# Altium project F143-MINI-KIT-902-FE-SMA_v1-0-2b.PrjPcb
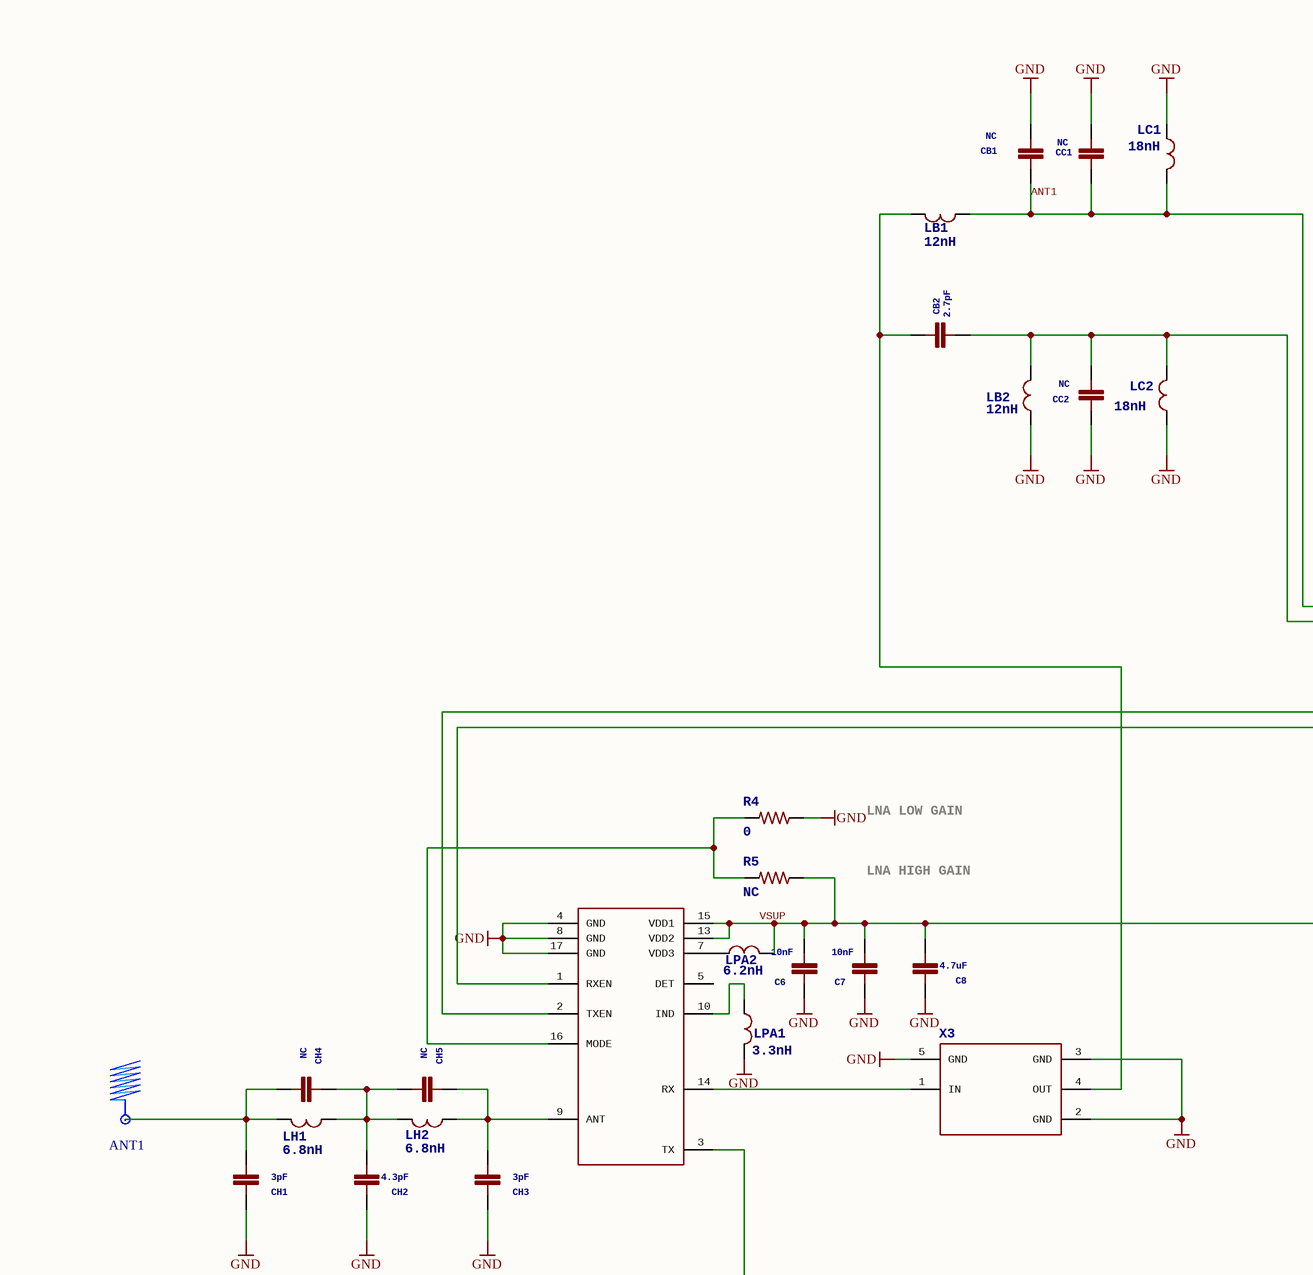
[diagram p0: F143-MINI-KIT-902-FE-SMA_v1-0-2b.SchDoc, top left]
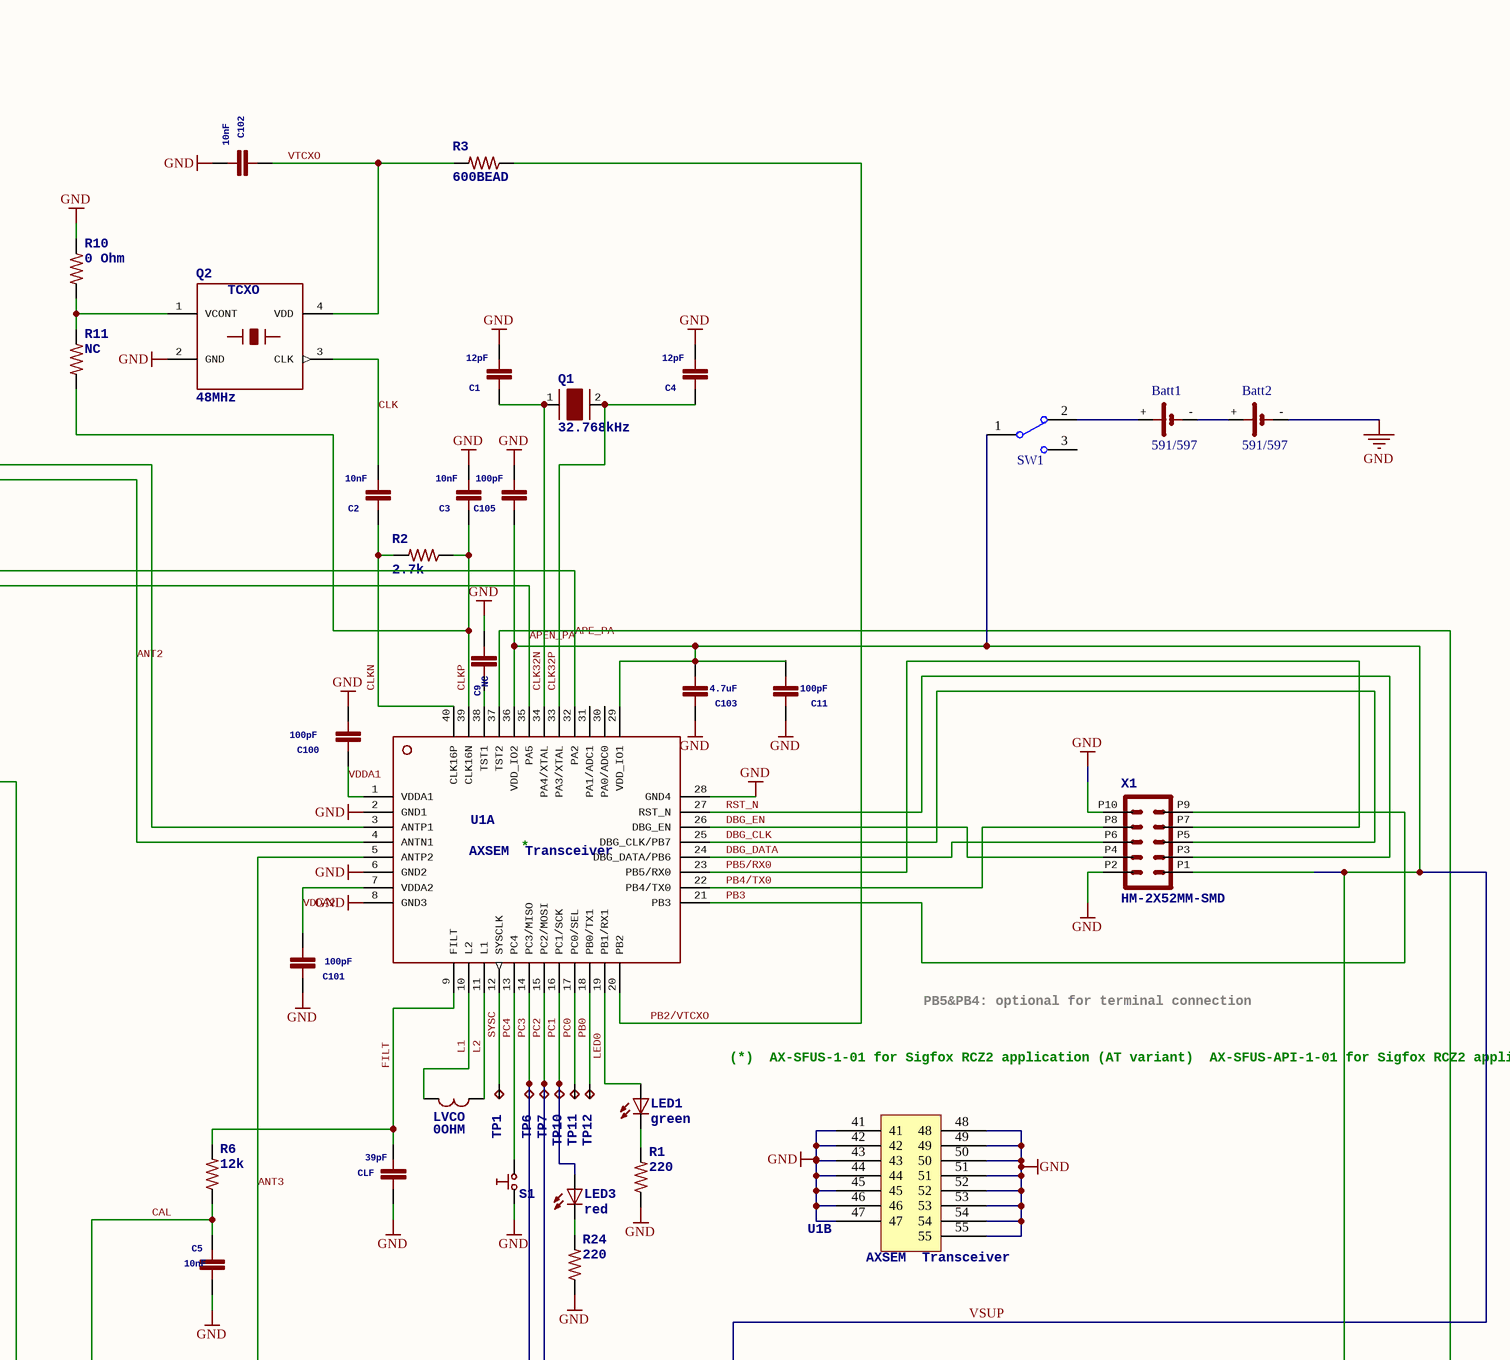
[diagram p1: F143-MINI-KIT-902-FE-SMA_v1-0-2b.SchDoc, top right]
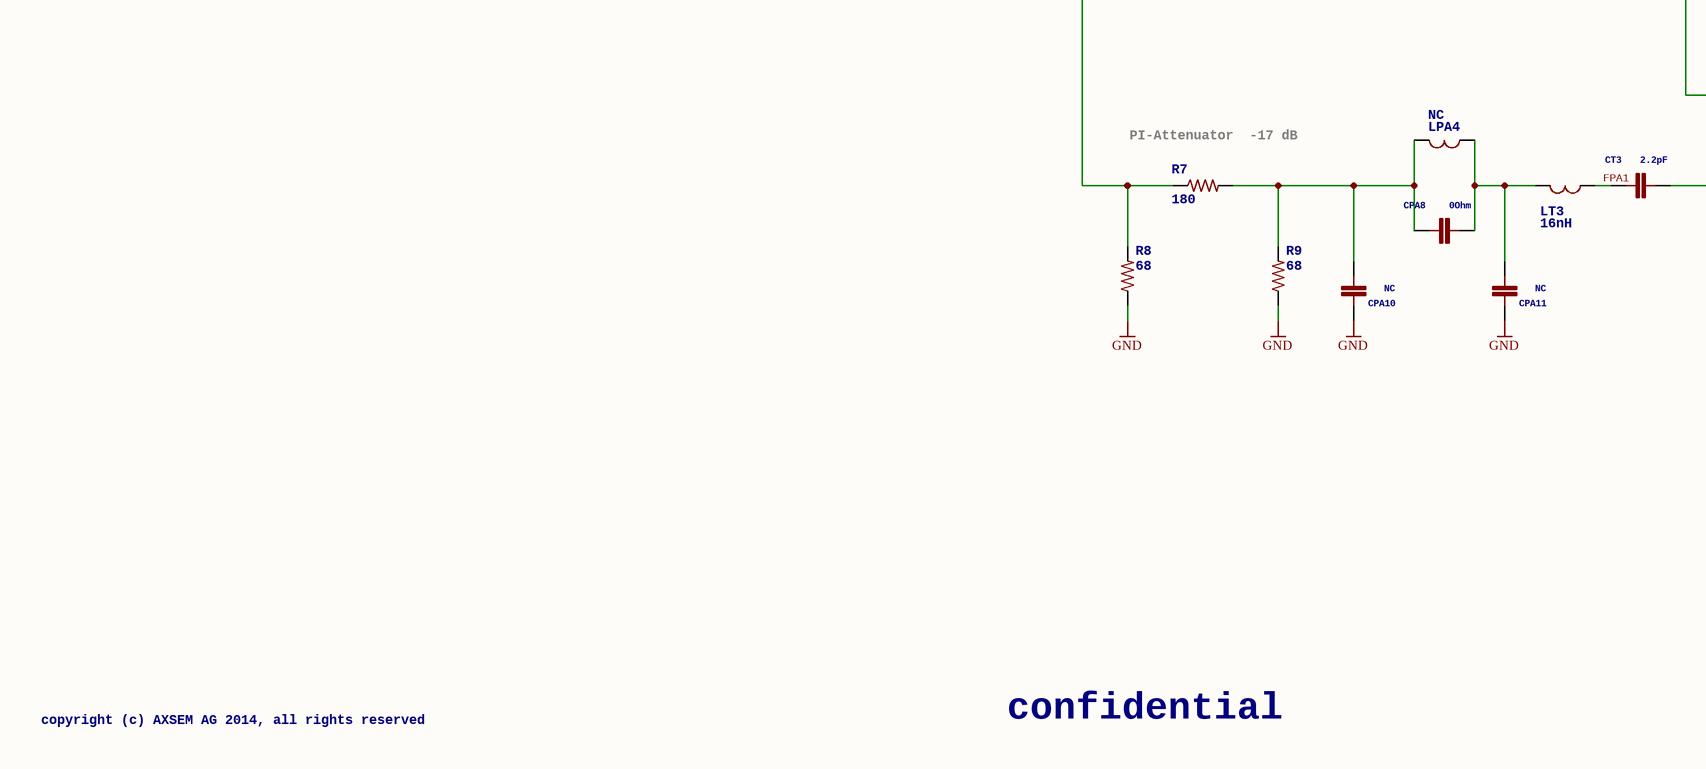
[diagram p2: F143-MINI-KIT-902-FE-SMA_v1-0-2b.SchDoc, bottom left]
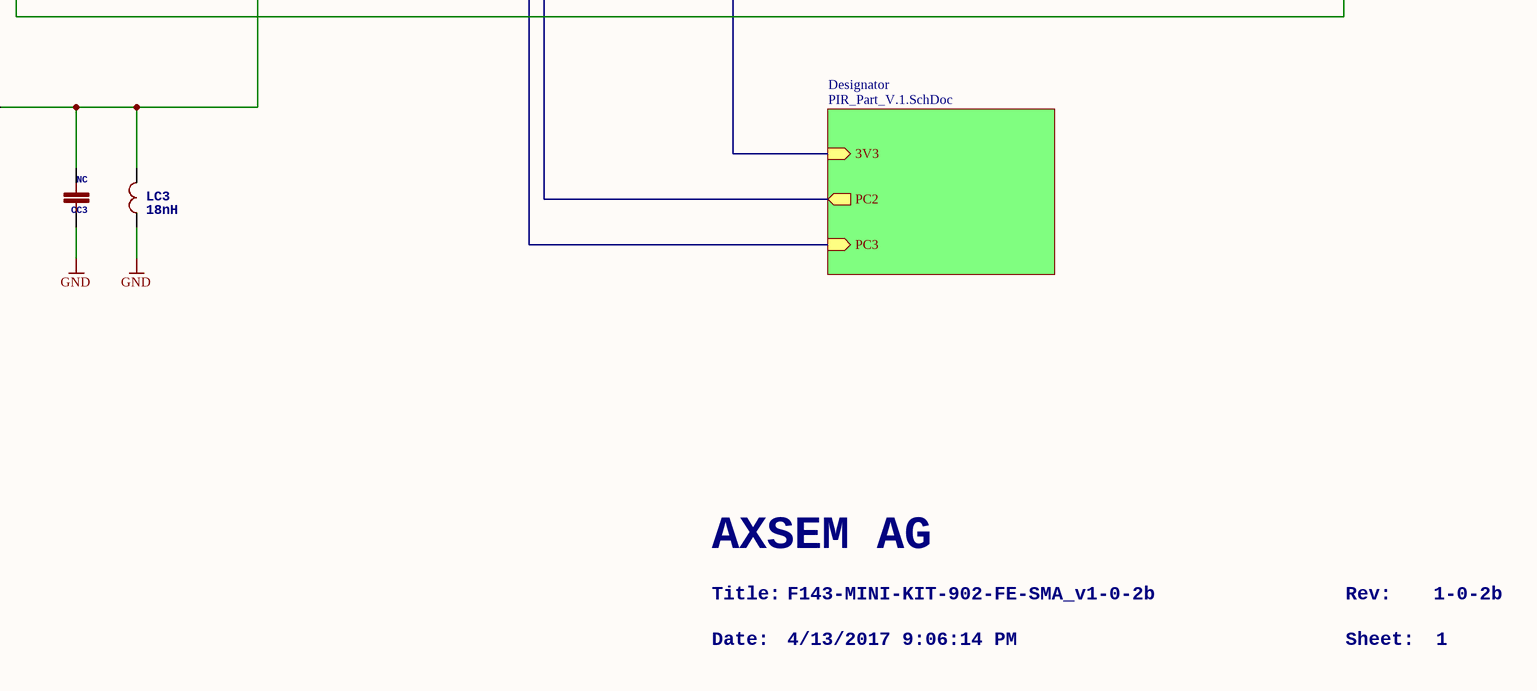
[diagram p3: F143-MINI-KIT-902-FE-SMA_v1-0-2b.SchDoc, bottom right]
2 sheets, 100 parts. Net scope: hierarchical (ports join the sheet entries above them; power ports are global).
Board file: F143-MINI-KIT-902-FE-SMA_v1-0-2b.PcbDoc
Sheets:
  F143-MINI-KIT-902-FE-SMA_v1-0-2b.SchDoc
    Designator = PIR_Part_V.1.SchDoc

## Sheet F143-MINI-KIT-902-FE-SMA_v1-0-2b.SchDoc: F143-MINI-KIT-902-FE-SMA_v1-0-2b
size 555 x 399 mm; Date: 4/13/2017 9:06:14 PM; SheetNumber: 1; REV: 1-0-2b

### Parts
ANT1  SW868-TH13  [Spring Antenna]  (value not drawn)
Batt1  591/597  [Battery Clip AAA]
Batt2  591/597  [Battery Clip AAA]
C1  12pF  [C0402]
C2  10nF  [C0402]
C3  10nF  [C0402]
C4  12pF  [C0402]
C5  10nF  [C0402]
C6  10nF  [C0402]
C7  10nF  [C0402]
C8  4.7uF  [C0603]
C9  NC  [C0402]
C11  100pF  [C0402]
C100  100pF  [C0402]
C101  100pF  [C0402]
C102  10nF  [C0402]
C103  4.7uF  [C0603]
C105  100pF  [C0402]
CB1  NC  [C0402]
CB2  2.7pF  [C0402]
CC1  NC  [C0402]
CC2  NC  [C0402]
CC3  NC  [C0402]
CH1  3pF  [C0402]
CH2  4.3pF  [C0402]
CH3  3pF  [C0402]
CH4  NC  [C0402]
CH5  NC  [C0402]
CLF  39pF  [C0402]
CPA8  0Ohm  [C0402]
CPA10  NC  [C0402]
CPA11  NC  [C0402]
CT3  2.2pF  [C0402]
LB1  12nH  [L0402]
LB2  12nH  [L0402]
LC1  18nH  [L0402]
LC2  18nH  [L0402]
LC3  18nH  [L0402]
LED1  green  [LED0603]
LED3  red  [LED0603]
LH1  6.8nH  [L0402]
LH2  6.8nH  [L0402]
LPA1  3.3nH  [L0402]
LPA2  6.2nH  [L0402]
LPA4  NC  [L0402]
LT3  16nH  [L0402]
LVCO  0OHM  [L0402]
Q1  32.768kHz  [TF20]
Q2  48MHz  [X2016]
R1  220  [R0402]
R2  2.7k  [R0402]
R3  600BEAD  [R0402]
R4  0  [R0402]
R5  NC  [R0402]
R6  12k  [R0402]
R7  180  [R0402]
R8  68  [R0402]
R9  68  [R0402]
R10  0 Ohm  [R0402]
R11  NC  [R0402]
R24  220  [R0402]
S1  (no value)  [TASTER_SMALL_SMD_4PAD]
SW1  MS-22D01  [SW MS-22D01]  (value not drawn)
TP1  (no value)  [PIN-03]
TP6  (no value)  [PIN-03]
TP7  (no value)  [PIN-03]
TP10  (no value)  [PIN-03]
TP11  (no value)  [PIN-03]
TP12  (no value)  [PIN-03]
U1  AXSEM
Transceiver: AXSEM / Transceiver  [QFN40]  (hidden comment: SFUSN)  (parts A,B of 2)
U$2  (no value)  [QFN16_TH]
X1  HM-2X52MM-SMD  [HM-2MM-2X5-SMD]
X3  (no value)  [SAW_1.4X1.1X0.5]

### Sub-sheets
Designator = PIR_Part_V.1.SchDoc: 3V3 (in), PC2 (out), PC3 (in)

### Nets
GND: Batt2.- C1.1 C3.1 C4.1 C5.2 C6.2 C7.2 C8.2 C9.1 C11.2 C100.1 C101.2 C102.1 C103.2 C105.1 CB1.2 CC1.2 CC2.1 CC3.2 CH1.2 CH2.2 CH3.2 CLF.2 CPA10.2 CPA11.2 LB2.1 LC1.1 LC2.1 LC3.1 LPA1.2 Q2.2(GND) R1.3 R4.3 R8.3 R9.3 R10.3 R24.3 S1.P3 U1.2(GND1) U1.6(GND2) U1.8(GND3) U1.28(GND4) U1.41 U1.42 U1.43 U1.44 U1.45 U1.46 U1.47 U1.48 U1.49 U1.50 U1.51 U1.52 U1.53 U1.54 U1.55 U$2.4(GND) U$2.8(GND) U$2.17(GND) X1.P2 X1.P10 X3.2(GND) X3.3(GND) X3.5(GND)
ANT1: CB1.1 CC1.1 LB1.1 LC1.2 U1.3(ANTP1)
ANT2: CB2.2 CC2.2 LB2.2 LC2.2 U1.4(ANTN1)
ANT3: CC3.1 CT3.2 LC3.2 U1.5(ANTP2)
APE_PA: U1.32(PA2) U$2.2(TXEN)
APEN_PA: U1.35(PA5) U$2.1(RXEN)
CAL: C5.1 R6.3 U1.37(TST2)
CLK: C2.1 Q2.3(CLK)
CLK32N: C1.2 Q1.1(P1) U1.34(PA4/XTAL)
CLK32P: C4.2 Q1.2(P2) U1.33(PA3/XTAL)
CLKN: C2.2 R2.4 U1.40(CLK16P)
CLKP: C3.2 R2.3 R11.4 U1.39(CLK16N)
DBG_CLK: U1.25(DBG_CLK/PB7) X1.P5
DBG_DATA: U1.24(DBG_DATA/PB6) X1.P6
DBG_EN: U1.26(DBG_EN) X1.P4
FILT: CLF.1 R6.4 U1.9(FILT)
FPA1: CT3.1 LT3.1
L1: LVCO.2 U1.10(L2)
L2: LVCO.1 U1.11(L1)
LED0: LED1.A U1.19(PB1/RX1)
PB0: TP12.P$1(TP) U1.18(PB0/TX1)
PB2/VTCXO: R3.3 U1.20(PB2)
PB3: U1.21(PB3) X1.P9
PB4/TX0: U1.22(PB4/TX0) X1.P8
PB5/RX0: U1.23(PB5/RX0) X1.P7
PC0: TP11.P$1(TP) U1.17(PC0/SEL)
PC1: LED3.A TP10.P$1(TP) U1.16(PC1/SCK)
PC2: TP7.P$1(TP) U1.15(PC2/MOSI) ; sheet Designator/PC2
PC3: TP6.P$1(TP) U1.14(PC3/MISO) ; sheet Designator/PC3
PC4: S1.P1 U1.13(PC4)
RST_N: U1.27(RST_N) X1.P3
SYSC: TP1.P$1(TP) U1.12(SYSCLK)
VDDA1: C100.2 U1.1(VDDA1)
VDDA2: C101.1 U1.7(VDDA2)
VSUP: C6.1 C7.1 C8.1 C11.1 C103.1 C105.2 LPA2.2 R5.3 SW1.1 U1.29(VDD_IO1) U1.36(VDD_IO2) U$2.13(VDD2) U$2.15(VDD1) X1.P1 ; sheet Designator/3V3
VTCXO: C102.2 Q2.4(VDD) R3.4
NetANT1_0: ANT1.0 CH1.1 CH4.1 LH1.1
NetBatt1_+: Batt1.+ SW1.2
NetBatt1_-: Batt1.- Batt2.+
NetC9_2: C9.2 U1.38(TST1)
NetCB2_1: CB2.1 LB1.2 X3.4(OUT)
NetCH2_1: CH2.1 CH4.2 CH5.1 LH1.2 LH2.1
NetCH3_1: CH3.1 CH5.2 LH2.2 U$2.9(ANT)
NetCPA8_1: CPA8.1 CPA10.1 LPA4.1 R7.4 R9.4
NetCPA8_2: CPA8.2 CPA11.1 LPA4.2 LT3.2
NetLED1_C: LED1.C R1.4
NetLED3_C: LED3.C R24.4
NetLPA1_1: LPA1.1 U$2.10(IND)
NetLPA2_1: LPA2.1 U$2.7(VDD3)
NetQ2_1: Q2.1(VCONT) R10.4 R11.3
NetR4_4: R4.4 R5.4 U$2.16(MODE)
NetR7_3: R7.3 R8.4 U$2.3(TX)
NetU$2_14: U$2.14(RX) X3.1(IN)

Not connected (* = marked no-connect by the designer): SW1 3; U1 30(PA0/ADC0) 31(PA1/ADC1); U$2 5(DET)

### Notes on the sheet
- LNA LOW GAIN
- LNA HIGH GAIN
- (near U1) *
- PB5&PB4: optional for terminal connection
- (*)
  AX-SFUS-1-01 for Sigfox RCZ2 application (AT variant)
  AX-SFUS-API-1-01 for Sigfox RCZ2 application (API variant)
  AX8052F143 for general purpose (non Sigfox) application
- (near R7) PI-Attenuator
  -17 dB
- AXSEM AG
- copyright (c) AXSEM AG 2014, all rights reserved
- confidential
- Date:
- Title:
- 4/13/2017 9:06:14 PM
- F143-MINI-KIT-902-FE-SMA_v1-0-2b
- Rev:
- Sheet:
- 1-0-2b
- 1

### Library data of the parts
ANT1 = spring antenna 868MHz 50Ohms 5W: SW868-TH13 Antenna; Frequency: 868MHz; Type: Spring Antenna; Reference: SW868-TH13
Batt1 Batt2 = Battery holder  AAA Keystone 591/597: Batt Holder AAA Keystone 591/597; Manufaturer: Keystone; Model: 591/597; Type: Batt Holder AAA TH; Batt Size: AAA
C1-C7 C9 C11 C100-C102 C105 CB1 CB2 CC1-CC3 CH1-CH5 CLF CPA8 CPA10 CPA11 CT3 = C0402
C8 C103 = C0603
LB1 LB2 LC1-LC3 LH1 LH2 LPA1 LPA2 LPA4 LT3 LVCO = L0402
LED1 LED3 = LED0603
Q1 = XTAL-2PINTF20
Q2 = TCXO: TCXO: TCXO
R1-R11 R24 = R0402
S1 = TASTER4-PAD-SMD-SMALL: AXSEM tasters
SW1 = Slide Switch MS-22D01: Slide Switch MS-22D01 2P2T; Rating: DC 6V 300mA; Part: MS-22D01; Type: slide switch spdt; Circuit: 2P2T
TP1 TP6 TP7 TP10-TP12 = TP03: Test pad
U1 = SFUSN: AX-SFUS-1-01 for Sigfox RCZ2 application (AT variant), AX-SFUS-API-1-01 for Sigfox RCZ2 application (API variant), AX8052F143 for general purpose (non Sigfox) application
U$2 = RFX1010
X3 = WFC30A0915FE

## Sheet PIR_Part_V.1.SchDoc
size A4; Author: ON semicoductor; CompanyName: ON Semiconductor Germany; DrawnBy: Magdalena Vaclavek; Revision: V.1; SheetNumber: 2; SheetTotal: 2; ProjectName: Axsem-PIR
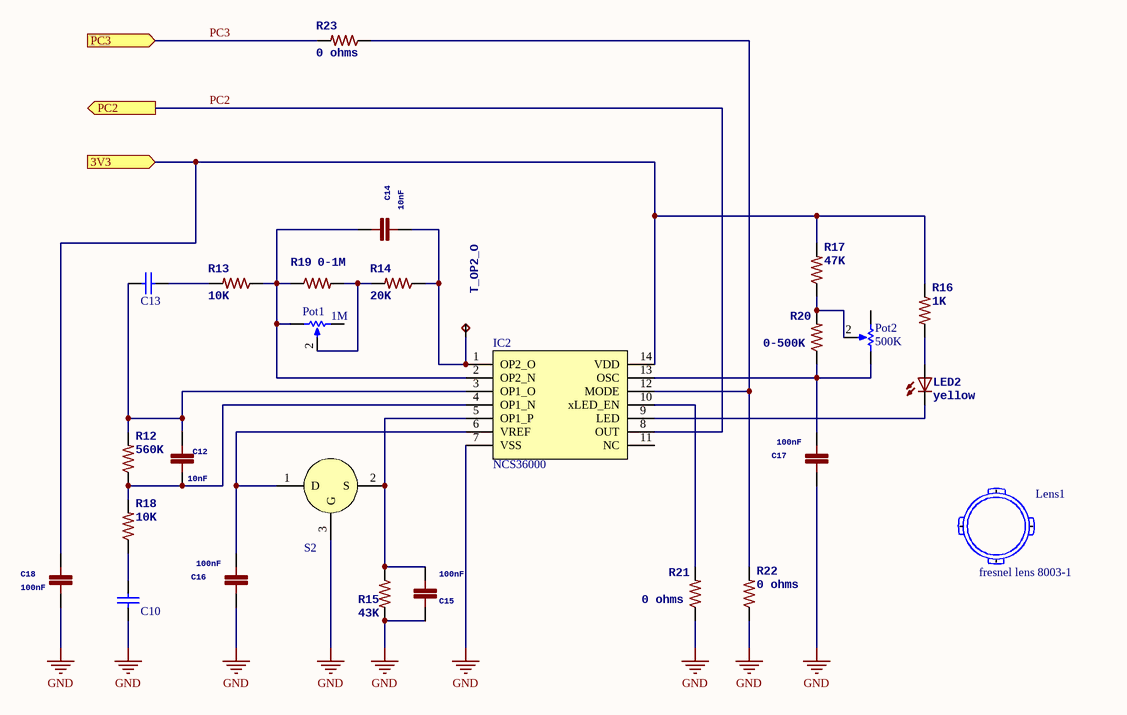
[diagram p4: PIR_Part_V.1.SchDoc]

### Parts
C10  33uF  [C1206]  (value not drawn)
C12  10nF  [C0402]
C13  33uF  [C1206]  (value not drawn)
C14  10nF  [C0402]
C15  100nF  [C0402]
C16  100nF  [C0402]
C17  100nF  [C0402]
C18  100nF  [C0603]
IC2  NCS36000  [SOIC127P600X175-14AN]
LED2  yellow  [LED0603 - Y]
Lens1  fresnel lens 8003-1  [Lens]
Pot1  1M  [Poti-4mm SMD]
Pot2  500K  [Poti-4mm SMD]
R12  560K  [R0402]
R13  10K  [R0402]
R14  20K  [R0402]
R15  43K  [R0402]
R16  1K  [R0402]
R17  47K  [R0402]
R18  10K  [R0402]
R19  0-1M  [R0402]
R20  0-500K  [R0402]
R21  0 ohms  [R0402]
R22  0 ohms  [R0402]
R23  0 ohms  [R0402]
S2  D203S  [ONSC-TO-5-3]  (value not drawn)
T_OP2_O  TP03  [PIN-03]  (value not drawn)

### Ports
3V3 (in), PC2 (out), PC3 (in)

### Nets
GND: C10.1 C15.1 C16.1 C17.1 C18.1 IC2.7(VSS) R15.2 R21.1 R22.1 S2.3(G)
PC2: IC2.8(OUT) ; port PC2
PC3: R23.2 ; port PC3
VSUP: C18.2 IC2.14(VDD) R16.1 R17.2 ; port 3V3
NetC10_2: C10.2 R18.1
NetC12_1: C12.1 C13.2 IC2.3(OP1_O) R12.2
NetC12_2: C12.2 IC2.4(OP1_N) R12.1 R18.2
NetC13_1: C13.1 R13.2
NetC14_1: C14.1 IC2.2(OP2_N) Pot1.1 R13.1 R19.1
NetC14_2: C14.2 IC2.1(OP2_O) R14.1 T_OP2_O.P$1(TP)
NetC15_2: C15.2 IC2.5(OP1_P) R15.1 S2.2(S)
NetC16_2: C16.2 IC2.6(VREF) S2.1(D)
NetC17_2: C17.2 IC2.13(OSC) Pot2.3 R20.1
NetIC2_9: IC2.9(LED) LED2.C
NetIC2_10: IC2.10(xLED_EN) R21.2
NetIC2_12: IC2.12(MODE) R22.2 R23.1
NetLED2_A: LED2.A R16.2
NetPot1_2: Pot1.2 R14.2 R19.2
NetPot2_2: Pot2.2 R17.1 R20.2

Not connected (* = marked no-connect by the designer): IC2 11(NC); Lens1 Tab1 Tab2 Tab3 Tab4; Pot1 3; Pot2 1

### Library data of the parts
C10 C13 = C1206: Value: 33uF
C12 C14-C17 = C0402
  C12 C14: Value: 10nF
  C15-C17: Value: 100nF
C18 = C0603: Value: 100nF
IC2 = NCS36000: PIR sensor; Manufacturer: ON semiconductor; Part Description: PIR controller; Part Number: NCS36000; Component Link: http://www.onsemi.com/PowerSolutions/product.do?id=NCS36000
LED2 = LED0603 yellow: LED0603-Y; Color red: red; Color green: green; Color yellow: yellow
Lens1 = PIR Fresnel Lens 8003-1: type: Fresnel Lens R11.4; Model: 8003-1; Reference: PIR Fresnel lens 8003-1
Pot1 Pot2 = Trimpot SMD: Bourns 3364W SMD 4mm square Trimpot; Manufaturer: Bourns; Model: 3364W; Type: Trimming Potentiometer SMD
  Pot1: Value: 1M
  Pot2: Value: 500K
R12-R23 = R0402
  R12: Value: 560K
  R13 R18: Value: 10K
  R14: Value: 20K
  R15: Value: 43K
  R16: Value: 1K
  R17: Value: 47K
  R19: Value: 0-1M
  R20: Value: 0-500K
  R21-R23: Value: 0 ohms
S2 = D203S PIR sensor: PIR sensor; Manufacturer: PIR sensor CO.,LTD; Manufacturer Part Number: D203S; Pin Count: 3; Part: D203S
T_OP2_O = TP03: Test pad

## Nets that join several sheets
GND: F143-MINI-KIT-902-FE-SMA_v1-0-2b (65 pins), PIR_Part_V.1 (10 pins)
PC2: F143-MINI-KIT-902-FE-SMA_v1-0-2b (TP7.P$1 U1.15), PIR_Part_V.1 (IC2.8)
PC3: F143-MINI-KIT-902-FE-SMA_v1-0-2b (TP6.P$1 U1.14), PIR_Part_V.1 (R23.2)
VSUP: F143-MINI-KIT-902-FE-SMA_v1-0-2b (14 pins), PIR_Part_V.1 (C18.2 IC2.14 R16.1 R17.2)